# EAGLE design OBD-II-UART (EAGLE 6.4)
DESCRIPTION: microOBD 200 OBD-II Module; HW_REV: 1.4; PCB_REV: C; PCB_SPEC1: Layer Count: 4; PCB_SPEC2: Size: 1.3" x 0.59"; PCB_SPEC3: Finish Thickness: 0.049" - 0.052"; PCB_SPEC4: Copper Weight: 1oz; TITLE: STM1120

## Sheet 1 of 4
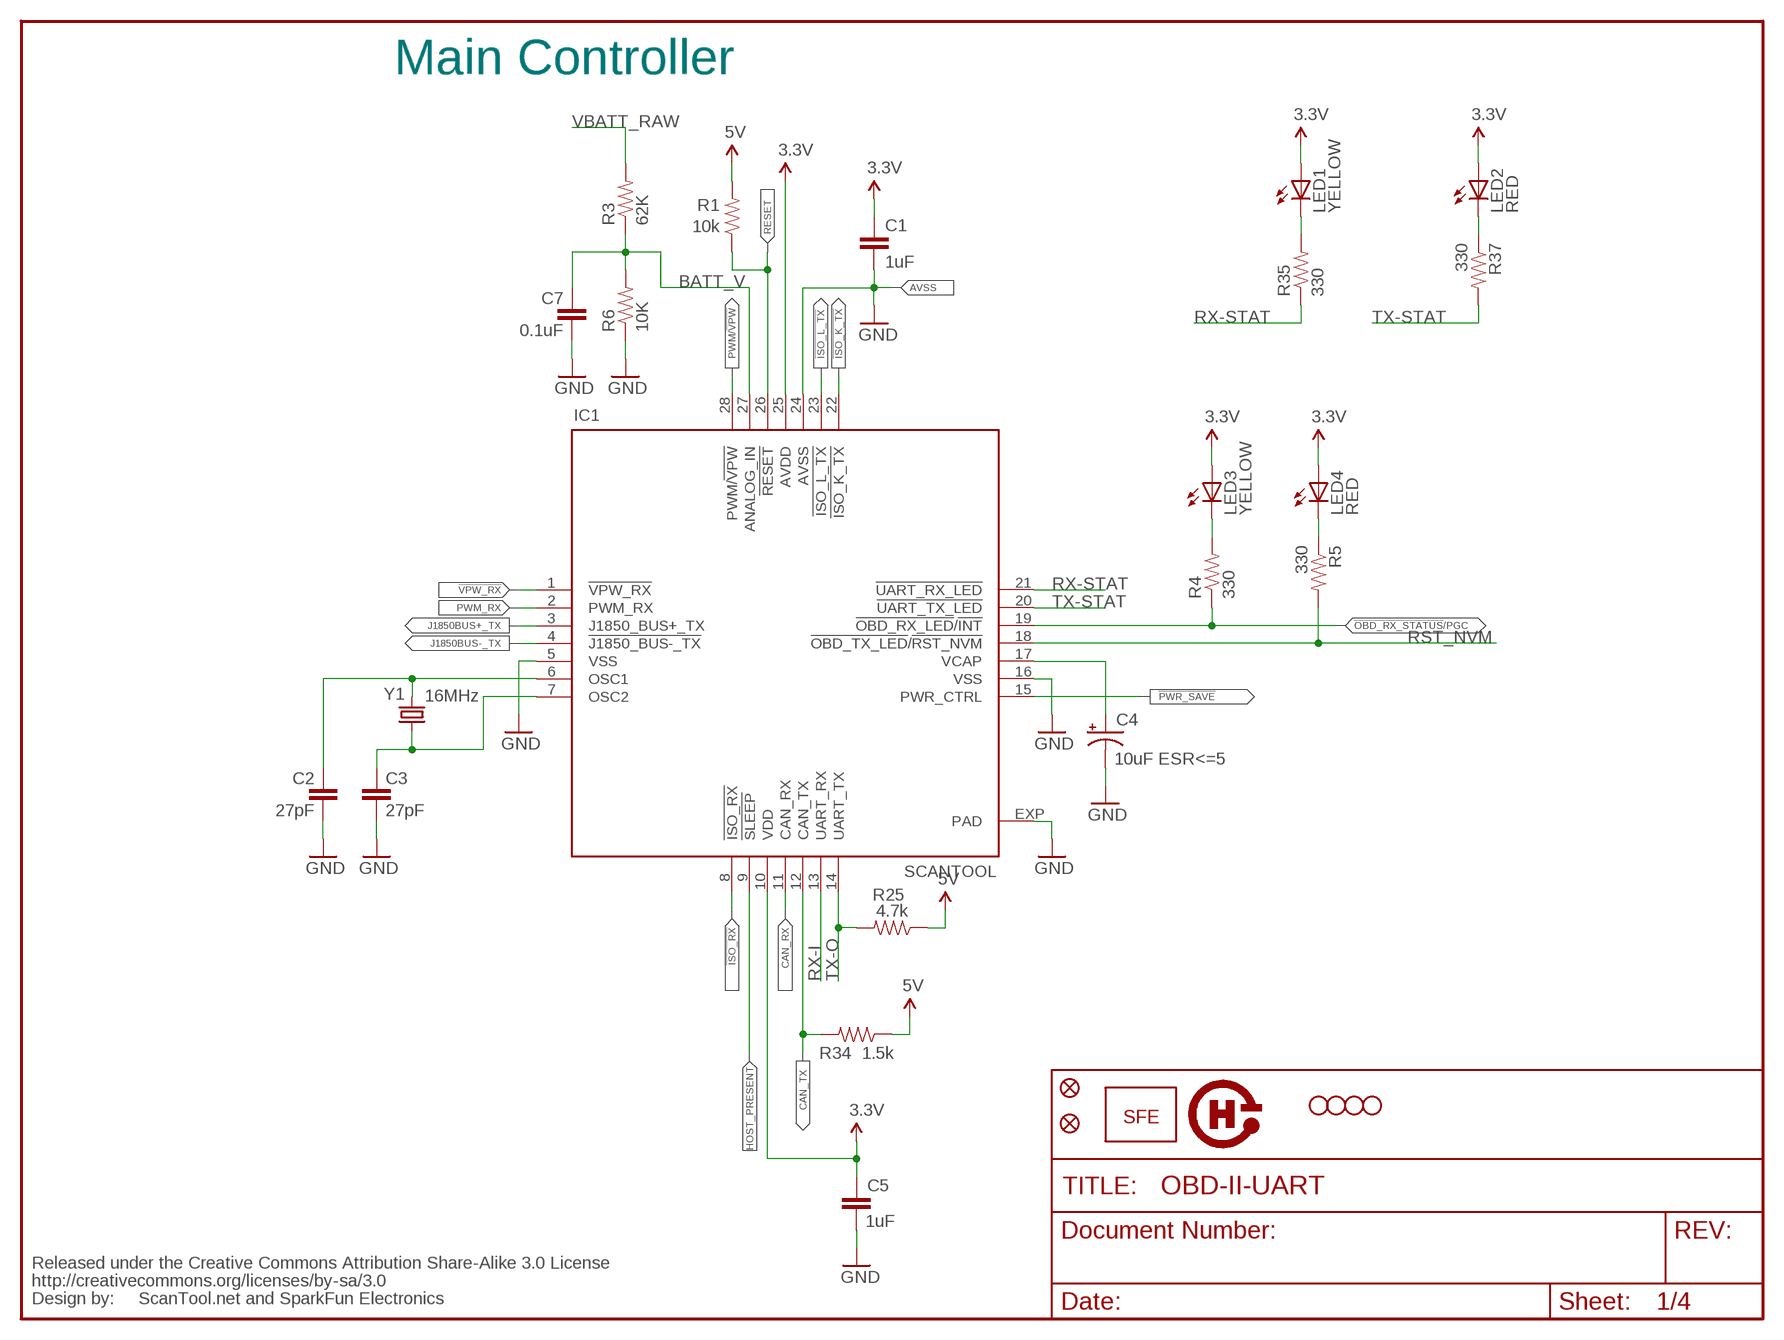
[diagram p0: schematic, sheet 1]

### Parts
C1  1uF  CAP0402-CAP  [0402-CAP]
C2  27pF  CAP0402-CAP  [0402-CAP]
C3  27pF  CAP0402-CAP  [0402-CAP]
C4  10uF ESR<=5  CAP_POL1206  [EIA3216]
C5  1uF  CAP0402-CAP  [0402-CAP]
C7  0.1uF  CAP0402-CAP  [0402-CAP]
IC1  SCANTOOL  [_STN_SCANTOOL_QFN-28-S]
JP2  FIDUCIAL1X2  [FIDUCIAL-1X2]
JP3  LOGO-SFENEW  [SFE-NEW-WEBLOGO]
JP4  STAND-OFF  [STAND-OFF]
JP5  STAND-OFF  [STAND-OFF]
JP6  STAND-OFF  [STAND-OFF]
JP7  STAND-OFF  [STAND-OFF]
JP10  FIDUCIAL1X2  [FIDUCIAL-1X2]
LED1  YELLOW  LED0603  [LED-0603]
LED2  RED  LED0603  [LED-0603]
LED3  YELLOW  LED0603  [LED-0603]
LED4  RED  LED0603  [LED-0603]
R1  10k  RESISTOR0402-RES  [0402-RES]
R3  62K  RESISTOR0402-RES  [0402-RES]
R4  330  RESISTOR0402-RES  [0402-RES]
R5  330  RESISTOR0402-RES  [0402-RES]
R6  10K  RESISTOR0402-RES  [0402-RES]
R25  4.7k  RESISTOR0402-RES  [0402-RES]
R34  1.5k  RESISTOR0402-RES  [0402-RES]
R35  330  RESISTOR0402-RES  [0402-RES]
R37  330  RESISTOR0402-RES  [0402-RES]
U$1  CREATIVE_COMMONS  [CREATIVE_COMMONS]
U$14  OSHW-LOGO  [OSHW-LOGO]
Y1  16MHz  CRYSTAL5X3  [CRYSTAL-SMD-5X3]

### Nets
3.3V: C1.1 C5.1 IC1.10(VDD) IC1.25(AVDD) LED1.A LED2.A LED3.A LED4.A ; also sheet 2,3,4
5V: R1.2 R25.1 R34.1 ; also sheet 2,3,4
!ISO_K_TX: IC1.22(!ISO_K_TX) ; also sheet 3
!ISO_L_TX: IC1.23(!ISO_L_TX) ; also sheet 3
!ISO_RX: IC1.8(!ISO_RX) ; also sheet 3
!OBD_RX_STATUS!/PGC: IC1.19(!OBD_RX_LED!/!INT) R4.1
!PWR_SAVE: IC1.15(PWR_CTRL)
!VPW_RX: IC1.1(!VPW_RX) ; also sheet 4
BATT_V: C7.1 IC1.27(ANALOG_IN) R3.1 R6.2
CAN_RX: IC1.11(CAN_RX) ; also sheet 3
CAN_TX: IC1.12(CAN_TX) R34.2 ; also sheet 3
GND: C1.2 C2.2 C3.2 C4.C(-) C5.2 C7.2 IC1.5(VSS) IC1.16(VSS) IC1.24(AVSS) IC1.EXP(PAD) R6.1 ; also sheet 2,3,4
HOST_PRESENT: IC1.9(!SLEEP)
J1850BUS+_TX: IC1.3(J1850_BUS+_TX) ; also sheet 4
J1850BUS-_TX: IC1.4(!J1850_BUS-_TX) ; also sheet 4
N$26: C4.A(+) IC1.17(VCAP)
N$30: LED3.C R4.2
N$31: LED4.C R5.1
N$35: LED1.C R35.2
N$36: LED2.C R37.1
OSC1: C2.1 IC1.6(OSC1) Y1.3
OSC2: C3.1 IC1.7(OSC2) Y1.1
PWM/!VPW: IC1.28(PWM/!VPW) ; also sheet 4
PWM_RX: IC1.2(PWM_RX) ; also sheet 4
RESET: IC1.26(!RESET) R1.1
RST_NVM: IC1.18(!OBD_TX_LED!/!RST_NVM) R5.2 ; also sheet 2
RX-I: IC1.13(UART_RX) ; also sheet 2
RX-STAT: IC1.21(!UART_RX_LED) R35.1
TX-O: IC1.14(UART_TX) R25.2 ; also sheet 2
TX-STAT: IC1.20(!UART_TX_LED) R37.2
VBATT_RAW: R3.2 ; also sheet 2

### Notes on the sheet
- Main Controller
- AVSS
- ScanTool.net and SparkFun Electronics

## Sheet 2 of 4
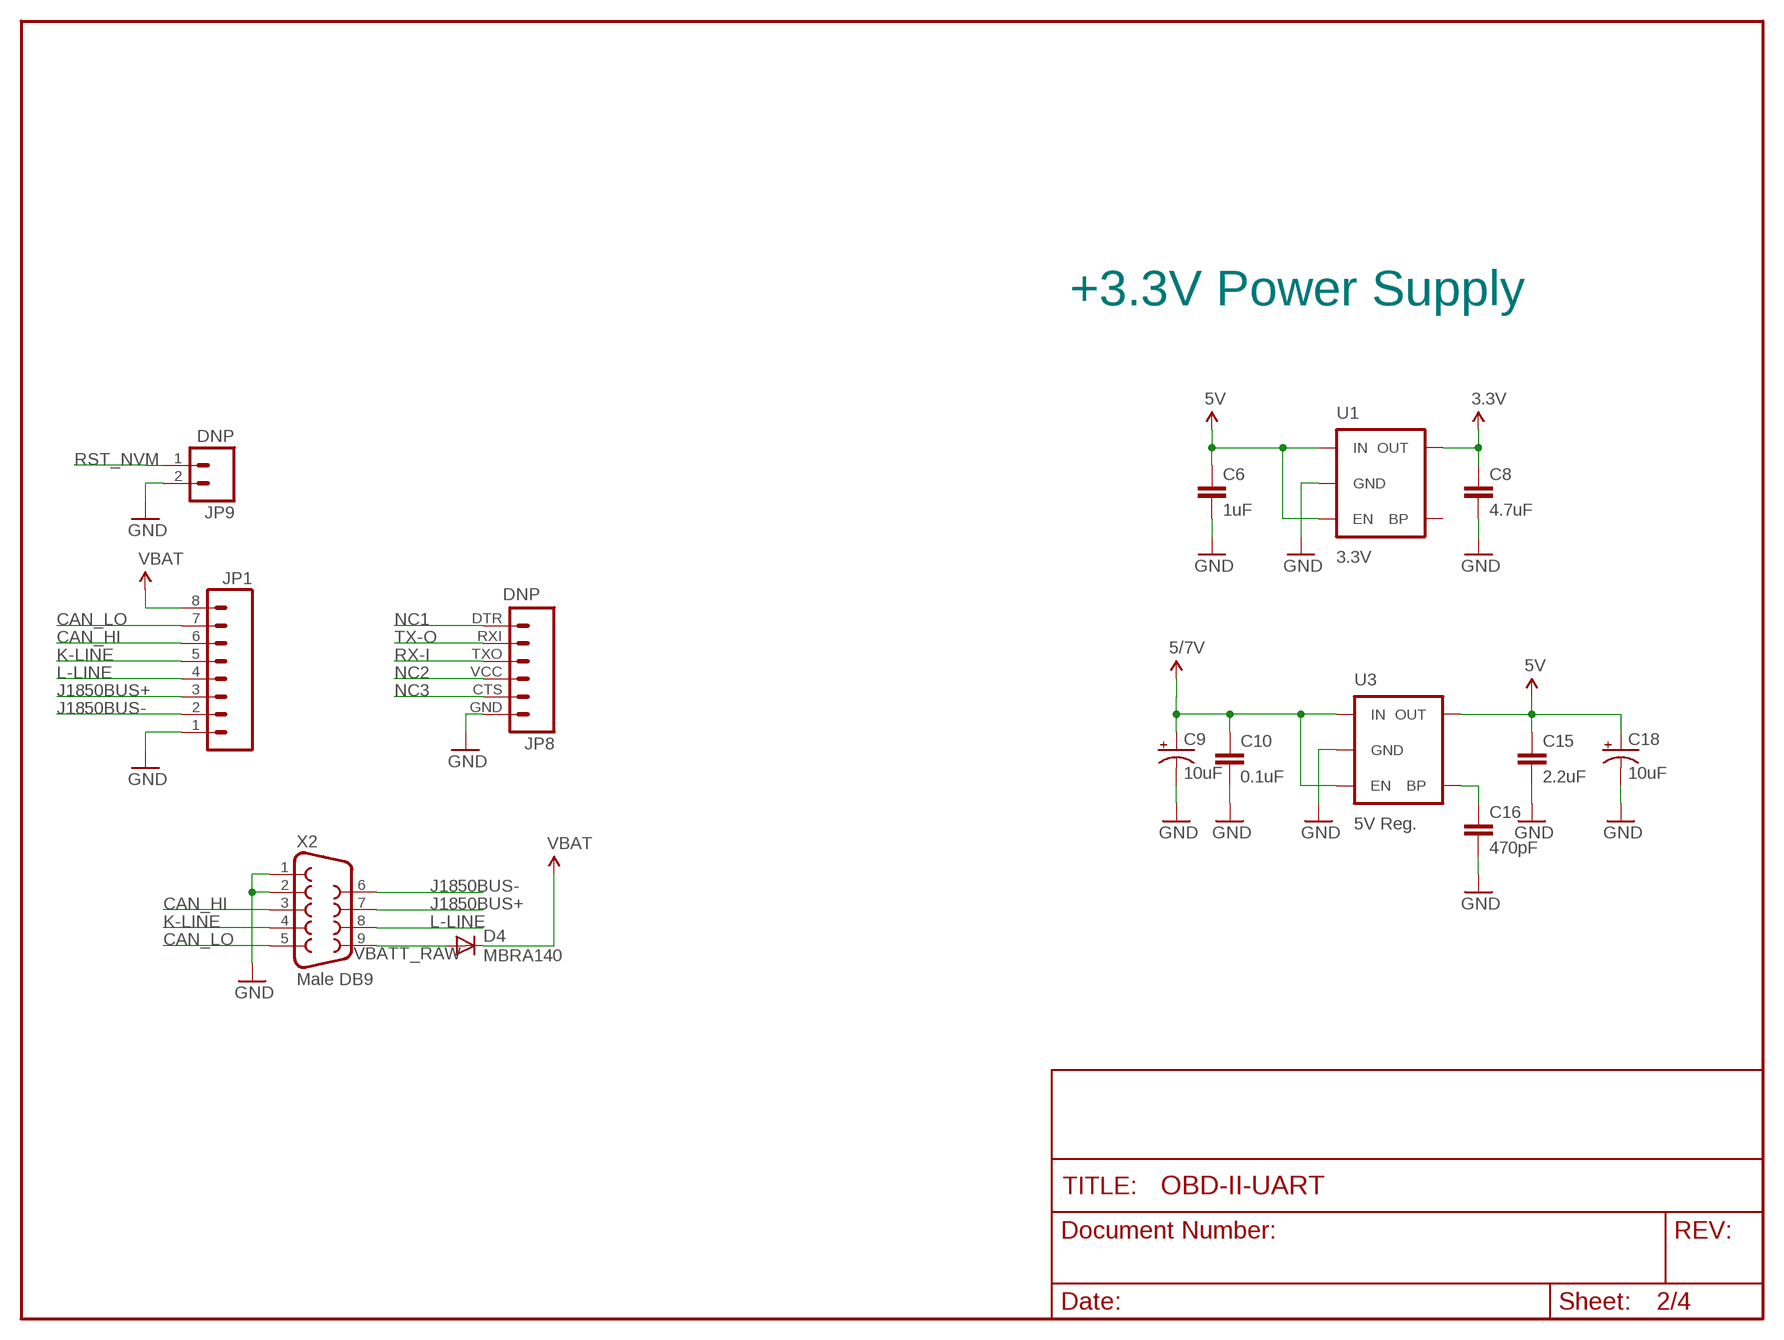
[diagram p1: schematic, sheet 2]

### Parts
C6  1uF  CAP0402-CAP  [0402-CAP]
C8  4.7uF  CAP0402-CAP  [0402-CAP]
C9  10uF  CAP_POL1206  [EIA3216]
C10  0.1uF  CAP0402-CAP  [0402-CAP]
C15  2.2uF  CAP0402-CAP  [0402-CAP]
C16  470pF  CAP0402-CAP  [0402-CAP]
C18  10uF  CAP_POL1206  [EIA3216]
D4  MBRA140  DIODESMA  [SMA-DIODE]
JP1  M08  [1X08]
JP8  DNP  FTDI_BASICPTH  [FTDI_BASIC]
JP9  DNP  M02PTH  [1X02]
U1  3.3V  V_REG_LDOSMD  [SOT23-5]
U3  5V Reg.  V_REG_LDOSMD  [SOT23-5]
X2  Male DB9  DB9MALE  [DB9_MALE]

### Nets
3.3V: C8.1 U1.5(OUT) ; also sheet 1,3,4
5V: C6.1 C15.1 C18.A(+) U1.1(IN) U1.3(EN) U3.5(OUT) ; also sheet 1,3,4
CAN_HI: JP1.6 X2.3 ; also sheet 3
CAN_LO: JP1.7 X2.5 ; also sheet 3
GND: C6.2 C8.2 C9.C(-) C10.2 C15.2 C16.2 C18.C(-) JP1.1 JP8.GND JP9.2 U1.2(GND) U3.2(GND) X2.1 X2.2 ; also sheet 1,3,4
J1850BUS+: JP1.3 X2.7 ; also sheet 4
J1850BUS-: JP1.2 X2.6 ; also sheet 4
K-LINE: JP1.5 X2.4 ; also sheet 3
L-LINE: JP1.4 X2.8 ; also sheet 3
N$34: C16.1 U3.4(BP)
NC1: JP8.DTR
NC2: JP8.VCC
NC3: JP8.CTS
RST_NVM: JP9.1 ; also sheet 1
RX-I: JP8.TXO ; also sheet 1
TX-O: JP8.RXI ; also sheet 1
VBAT: D4.C JP1.8 ; also sheet 3,4
VBATT_RAW: D4.A X2.9 ; also sheet 1
VCC: C9.A(+) C10.1 U3.1(IN) U3.3(EN) ; supply symbol labelled 5/7V ; also sheet 4
Unconnected: U1.4(BP)

### Notes on the sheet
- +3.3V Power Supply

## Sheet 3 of 4
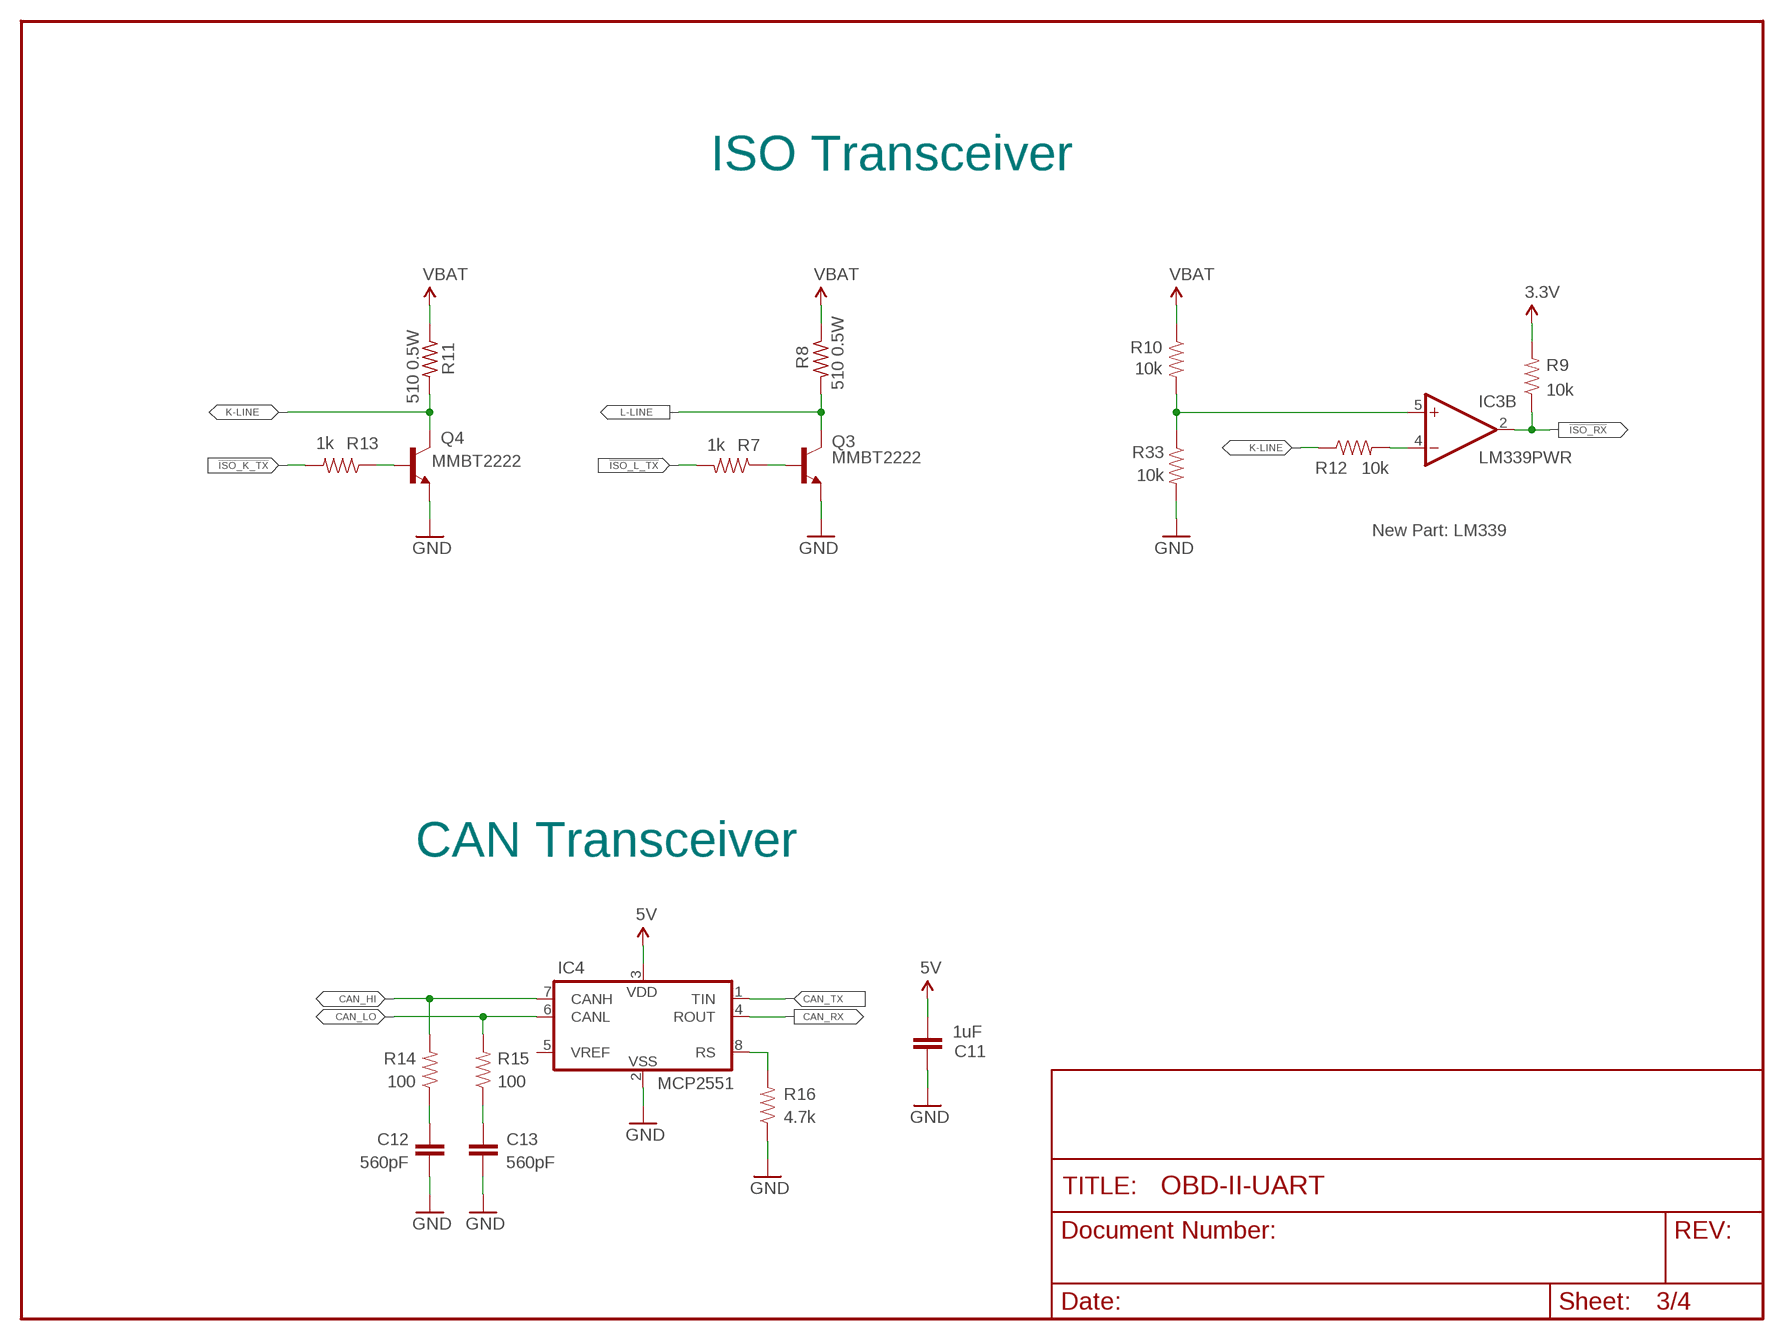
[diagram p2: schematic, sheet 3]

### Parts
C11  1uF  CAP0402-CAP  [0402-CAP]
C12  560pF  CAP0402-CAP  [0402-CAP]
C13  560pF  CAP0402-CAP  [0402-CAP]
IC3  LM339PWR  [TSSOP-14]
IC4  MCP2551  MCP2551-I/SN  [SO-8]
Q3  MMBT2222  TRANSISTOR_NPNSOT23-3  [SOT23-3]
Q4  MMBT2222  TRANSISTOR_NPNSOT23-3  [SOT23-3]
R7  1k  RESISTOR0402-RES  [0402-RES]
R8  510 0.5W  R-US_2010  [2010]
R9  10k  RESISTOR0402-RES  [0402-RES]
R10  10k  RESISTOR0402-RES  [0402-RES]
R11  510 0.5W  R-US_2010  [2010]
R12  10k  RESISTOR0402-RES  [0402-RES]
R13  1k  RESISTOR0402-RES  [0402-RES]
R14  100  RESISTOR0402-RES  [0402-RES]
R15  100  RESISTOR0402-RES  [0402-RES]
R16  4.7k  RESISTOR0402-RES  [0402-RES]
R33  10k  RESISTOR0402-RES  [0402-RES]

### Nets
3.3V: R9.2 ; also sheet 1,2,4
5V: C11.1 IC4.3(VDD) ; also sheet 1,2,4
!ISO_K_TX: R13.2 ; also sheet 1
!ISO_L_TX: R7.2 ; also sheet 1
!ISO_RX: IC3.2(B:OUT) R9.1 ; also sheet 1
CAN_HI: IC4.7(CANH) R14.2 ; also sheet 2
CAN_LO: IC4.6(CANL) R15.2 ; also sheet 2
CAN_RX: IC4.4(ROUT) ; also sheet 1
CAN_TX: IC4.1(TIN) ; also sheet 1
GND: C11.2 C12.2 C13.2 IC4.2(VSS) Q3.2(E) Q4.2(E) R16.1 R33.2 ; also sheet 1,2,4
K-LINE: Q4.3(C) R11.2 R12.1 ; also sheet 2
L-LINE: Q3.3(C) R8.2 ; also sheet 2
N$4: Q4.1(B) R13.1
N$5: Q3.1(B) R7.1
N$6: IC3.5(B:+IN) R10.2 R33.1
N$10: C12.1 R14.1
N$11: IC4.8(RS) R16.2
N$13: IC3.4(B:-IN) R12.2
N$27: C13.1 R15.1
VBAT: R8.1 R10.1 R11.1 ; also sheet 2,4
Unconnected: IC3.10(D:-IN) IC3.11(D:+IN) IC3.13(D:OUT) IC4.5(VREF)

### Notes on the sheet
- ISO Transceiver
- New Part: LM339
- CAN Transceiver

## Sheet 4 of 4
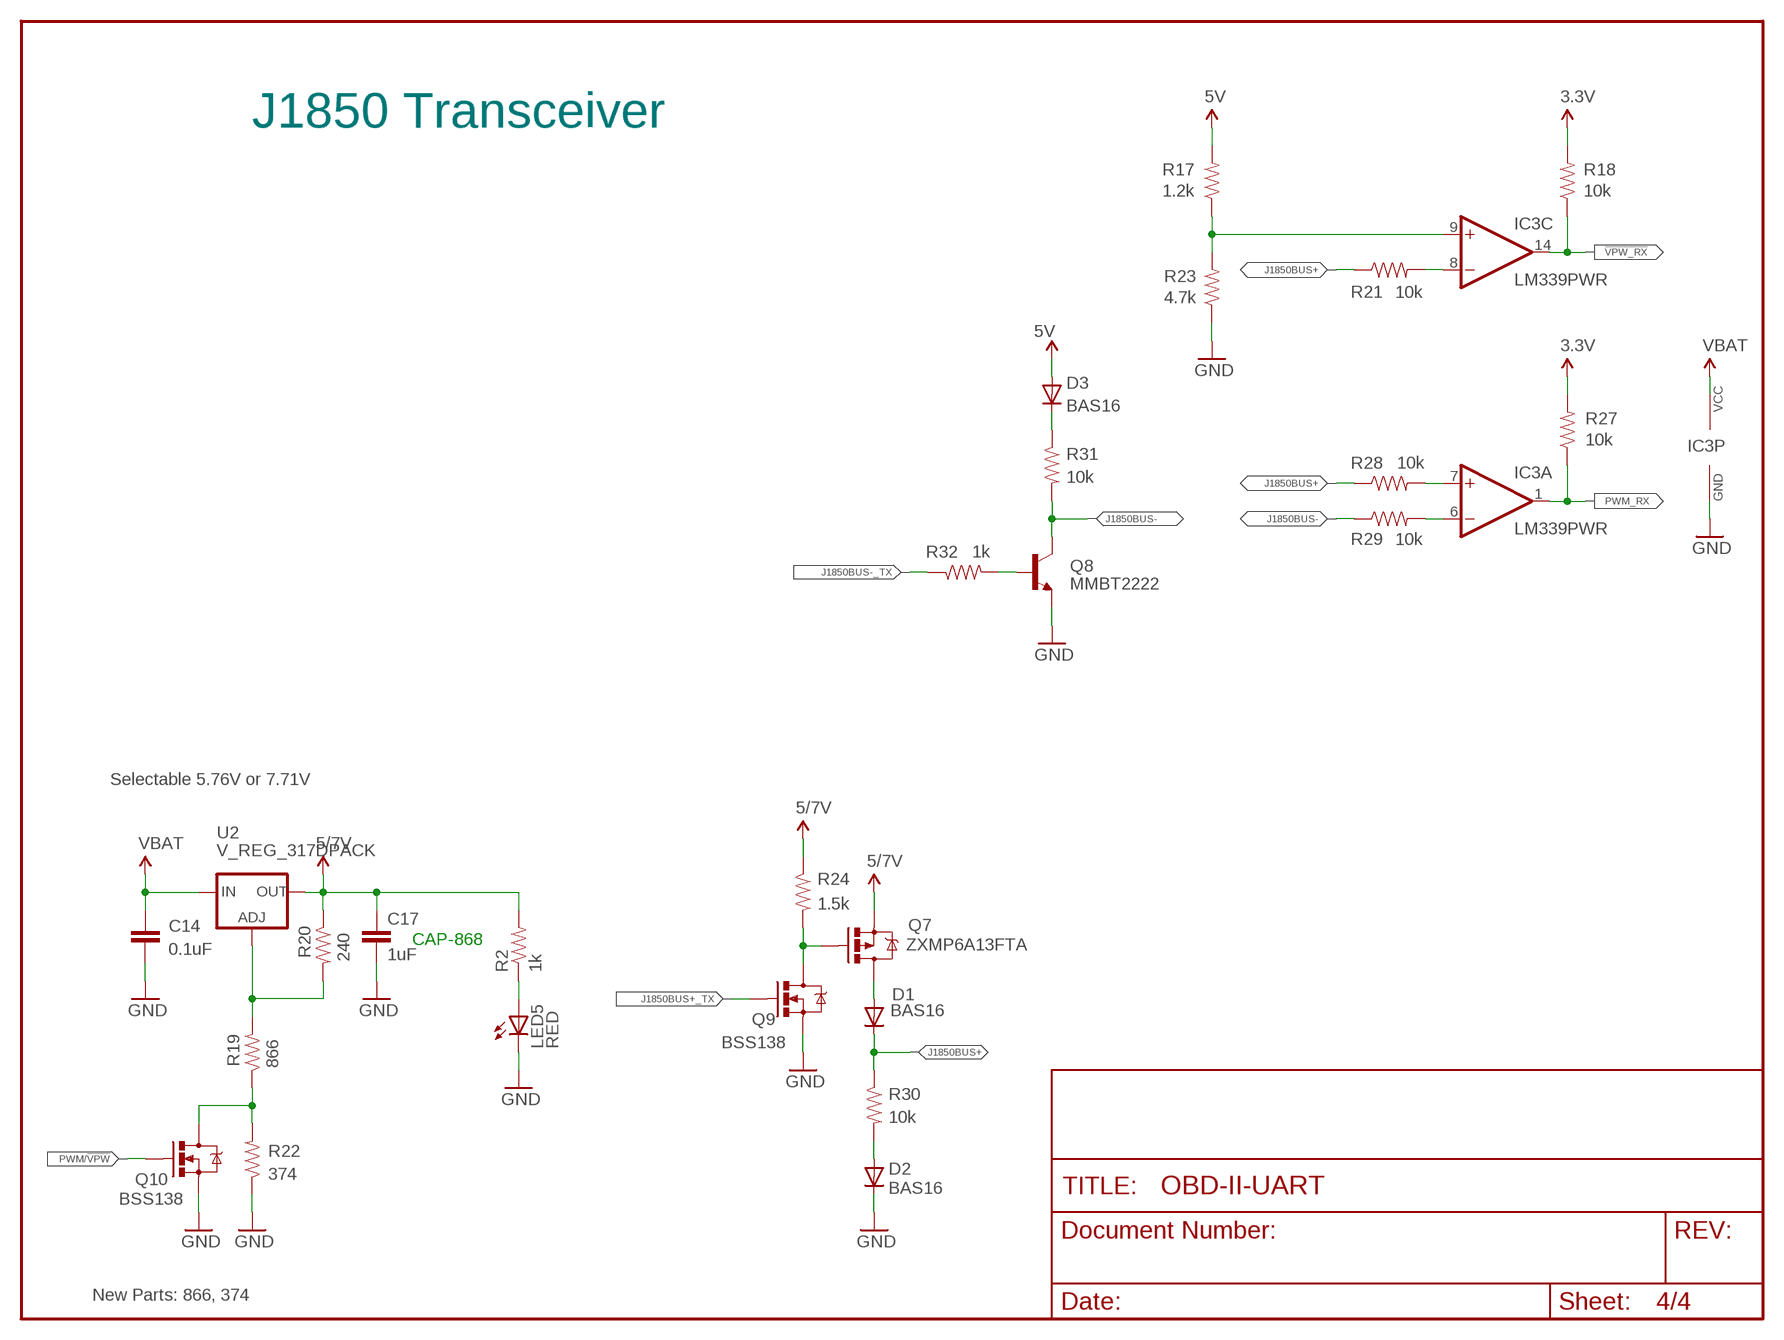
[diagram p3: schematic, sheet 4]

### Parts
C14  0.1uF  CAP0402-CAP  [0402-CAP]
C17  1uF  CAP0402-CAP  [0402-CAP]
D1  BAS16  DIODESOD  [SOD-323]
D2  BAS16  DIODESOD  [SOD-323]
D3  BAS16  DIODESOD  [SOD-323]
LED5  RED  LED0603  [LED-0603]
Q7  ZXMP6A13FTA  MOSFET-PCHANNEL  [SOT23]
Q8  MMBT2222  TRANSISTOR_NPNSOT23-3  [SOT23-3]
Q9  BSS138  MOSFET-NCHANNELSMD  [SOT23-3]
Q10  BSS138  MOSFET-NCHANNELSMD  [SOT23-3]
R2  1k  RESISTOR0402-RES  [0402-RES]
R17  1.2k  RESISTOR0402-RES  [0402-RES]
R18  10k  RESISTOR0402-RES  [0402-RES]
R19  866  RESISTOR0402-RES  [0402-RES]
R20  240  RESISTOR0402-RES  [0402-RES]
R21  10k  RESISTOR0402-RES  [0402-RES]
R22  374  RESISTOR0402-RES  [0402-RES]
R23  4.7k  RESISTOR0402-RES  [0402-RES]
R24  1.5k  RESISTOR0402-RES  [0402-RES]
R27  10k  RESISTOR0402-RES  [0402-RES]
R28  10k  RESISTOR0402-RES  [0402-RES]
R29  10k  RESISTOR0402-RES  [0402-RES]
R30  10k  RESISTOR0402-RES  [0402-RES]
R31  10k  RESISTOR0402-RES  [0402-RES]
R32  1k  RESISTOR0402-RES  [0402-RES]
U2  V_REG_317DPACK  [V-REG_DPACK]

### Nets
3.3V: R18.2 R27.2 ; also sheet 1,2,3
5V: D3.2(A) R17.2 ; also sheet 1,2,3
!VPW_RX: IC3.14(C:OUT) R18.1 ; also sheet 1
GND: C14.2 C17.2 D2.1(C) IC3.12(P:GND) LED5.C Q8.2(E) Q9.2(S) Q10.2(S) R22.1 R23.1 ; also sheet 1,2,3
J1850BUS+: D1.1(C) R21.1 R28.1 R30.1 ; also sheet 2
J1850BUS+_TX: Q9.1(G) ; also sheet 1
J1850BUS-: Q8.3(C) R29.1 R31.2 ; also sheet 2
J1850BUS-_TX: R32.1 ; also sheet 1
N$1: IC3.7(A:+IN) R28.2
N$3: IC3.6(A:-IN) R29.2
N$7: IC3.8(C:-IN) R21.2
N$8: R19.2 R20.2 U2.1(ADJ)
N$9: D1.2(A) Q7.3(D)
N$12: IC3.9(C:+IN) R17.1 R23.2
N$14: D3.1(C) R31.1
N$18: Q7.1(G) Q9.3(D) R24.2
N$22: Q10.3(D) R19.1 R22.2
N$24: D2.2(A) R30.2
N$25: Q8.1(B) R32.2
N$32: LED5.A R2.1
PWM/!VPW: Q10.1(G) ; also sheet 1
PWM_RX: IC3.1(A:OUT) R27.1 ; also sheet 1
VBAT: C14.1 IC3.3(P:VCC) U2.3(IN) ; also sheet 2,3
VCC: C17.1 Q7.2(S) R2.2 R20.1 R24.1 U2.4(OUT) ; supply symbol labelled 5/7V ; also sheet 2

### Notes on the sheet
- J1850 Transceiver
- Selectable 5.76V or 7.71V
- CAP-868
- New Parts: 866, 374

## Library data of the parts
C1-C3 C5-C8 C10-C17 = SparkFun:CAP: Capacitor Standard 0603 ceramic capacitor, and 0.1" leaded capacitor.
C4 C9 C18 = SparkFun:CAP_POL: Capacitor Polarized These are standard SMD and PTH capacitors. Normally 10uF, 47uF, and 100uF in electrolytic and tantalum varieties. Always verify the external diameter of the through hole cap, it varies with capacity, voltage, and manufacturer. The EIA devices should be standard.
D1-D4 = SparkFun:DIODE: Diode These are standard reverse protection diodes and small signal diodes. SMA package can handle up to about 1A. SOD-323 can handle about 200mA. What the SOD-323 package when ordering, there are some mfgs out there that are 5-pin packages.
IC1 = SparkFun:SCANTOOL: STN1110 - Multiprotocol OBD II to UART Interpreter, QFN Package Change Log Date Author Change Aug 23, 2010 vit@scantool.net Created device
IC3 = _stn_logic:LM339PWR: Quad Differential Comparators Based on information from the SLCS006N datasheet from TI (www.ti.com). Change Log Date Author Change July 16, 2008 nick@scantool.net Device created.; DESC: IC, Quad Comparator; MANUF: Texas Instruments; PARTNUM: LM339PWR; SUPPLIER: Digikey:296-6607-1-ND; VALSTAT: PARTNUM
IC4 = _stn_microchip:MCP2551: CAN Driver Based on information from the MPC2551 datasheet from Microchip. http://www.microchip.com/ Change Log Date Author Change November 12, 2008 joe@scantool.net Renamed "TXD" to "TIN" and "RXD" to "ROUT" Fixed mislabeled pins "CANH" and CANL"; DESC: IC, CAN Transceiver; MANUF: Microchip Technology; PARTNUM: MCP2551-I/SN; SUPPLIER: Digikey:MCP2551-I/SN-ND; VALSTAT: PARTNUM
JP1 = SparkFun:M08: Header 8 Standard 8-pin 0.1" header. Use with straight break away headers (SKU : PRT-00116), right angle break away headers (PRT-00553), swiss pins (PRT-00743), machine pins (PRT-00117), and female headers (PRT-00115).
JP2 JP10 = SparkFun:FIDUCIAL: Fiducial Alignment Points Various fiducial points for machine vision alignment.
JP3 = SparkFun:LOGO-SFE: Spark Fun Electronics PCB Logo This is the standard Spark Fun Electronics PCB logo.
JP4-JP7 = SparkFun:STAND-OFF: Stand Off This is the mechanical footprint for a #4 phillips button head screw. Use the keepout ring to avoid running the screw head into surrounding components. SKU : PRT-00447
JP8 = SparkFun:FTDI_BASIC: FTDI Basic: 3.3V and 5V
JP9 = SparkFun:M02: Header 2 Standard 2-pin 0.1" header. Use with straight break away headers (SKU : PRT-00116), right angle break away headers (PRT-00553), swiss pins (PRT-00743), machine pins (PRT-00117), and female headers (PRT-00115). Molex polarized connector foot print use with SKU : PRT-08233 with associated crimp pins and housings.
LED1-LED5 = SparkFun:LED: LEDs Standard schematic elements and footprints for 5mm, 3mm, 1206, and 0603 sized LEDs. 5mm - Spark Fun Electronics SKU : COM-00529 (and others)
Q3 Q4 Q8 = SparkFun:TRANSISTOR_NPN: Transistor NPN BJT configuration in SOT23 package. MMBT2222 is the common NPN we use. Double check BCE configuration again layout.
Q7 = SparkFun:MOSFET-PCHANNEL
Q9 Q10 = SparkFun:MOSFET-NCHANNEL
R1-R7 R9 R10 R12-R25 R27-R35 R37 = SparkFun:RESISTOR: Resistor Basic schematic elements and footprints for 0603, 1206, and PTH resistors.
R8 R11 = _stn_rcl:R-US: Resistor, US Symbol Change Log Date Author Change November 13, 2006 vit@scantool.net Moved underscore from the end of device name to beginning of variant names. May 27, 2006 vitaliy@scantool.net Added description.; DESC: Resistor; VALSTAT: VAL
U1 U3 = SparkFun:V_REG_LDO: Voltage Regulator LDO Standard 150mA LDO voltage regulator in SOT-23 layout. Micrel part MIC5205. BP (by-pass) pin is used to lower output noise with 470pF cap.
U2 = SparkFun:V_REG_317: Voltage Regulator Standard LM317 adjustable voltage regulator. AOI (Adjust Output Input). Google 'LM317 Calculator' for easy to use app to get the two resistor values needed. 240/720 for 5V output. 240/390 for 3.3V output. Spark Fun Electronics SKU : COM-00527
U$1 = SparkFun:CREATIVE_COMMONS
U$14 = OSHW:OSHW-LOGO
X2 = SparkFun:DB9: DB9 Connector Standard DB9 (D-Sub 9) serial connector. Can be used for CAN bus as well as RS485 and RS232. Footprint production proven. Spark Fun Electronics SKU : PRT-00429
Y1 = SparkFun:CRYSTAL: Crystals Various standard crystals. Proven footprints. Spark Fun Electronics SKU : COM-00534

## Board
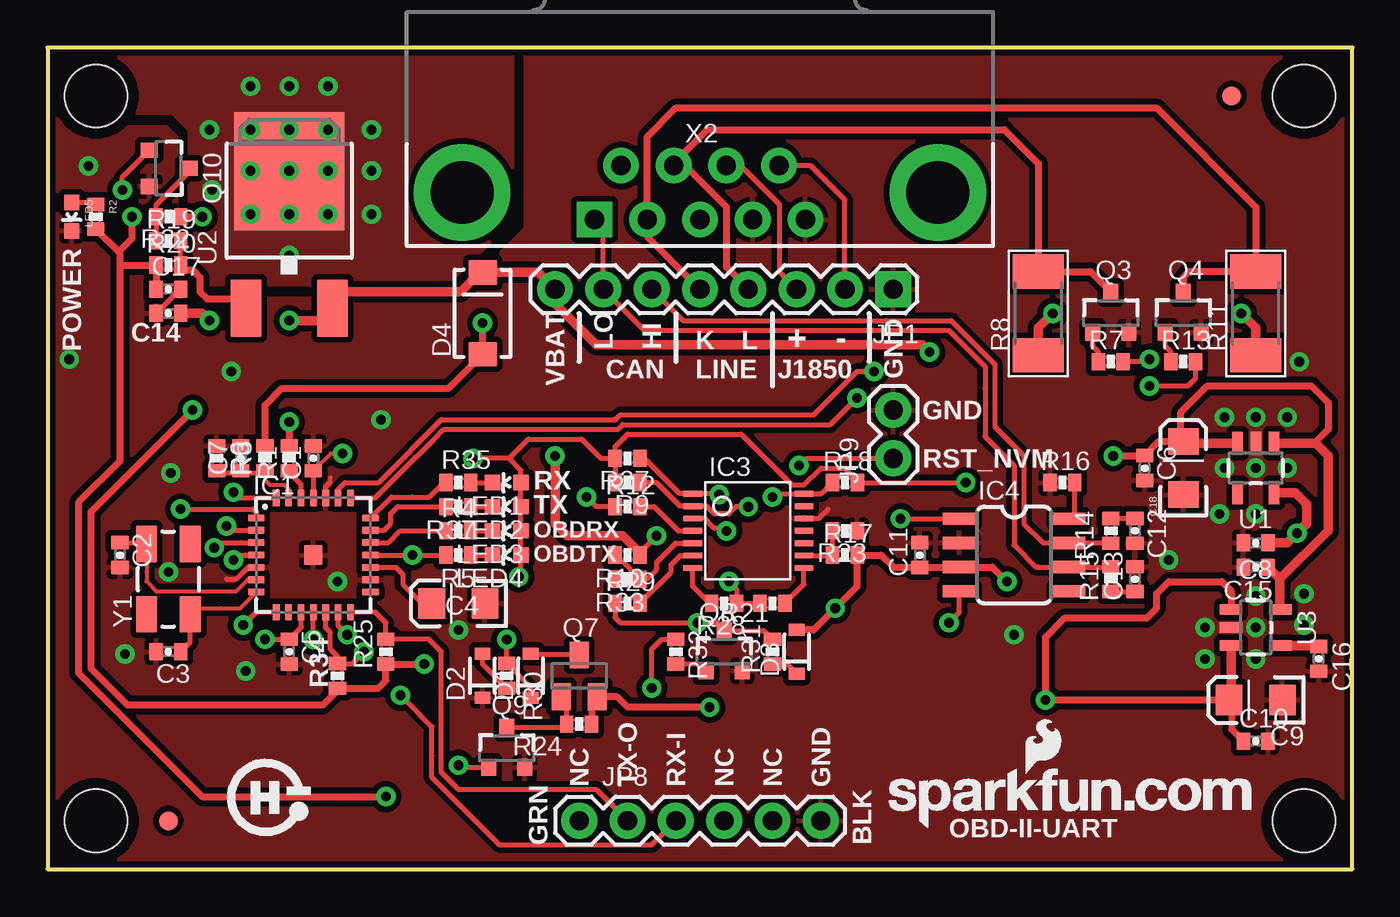
[diagram p4: board, top side]
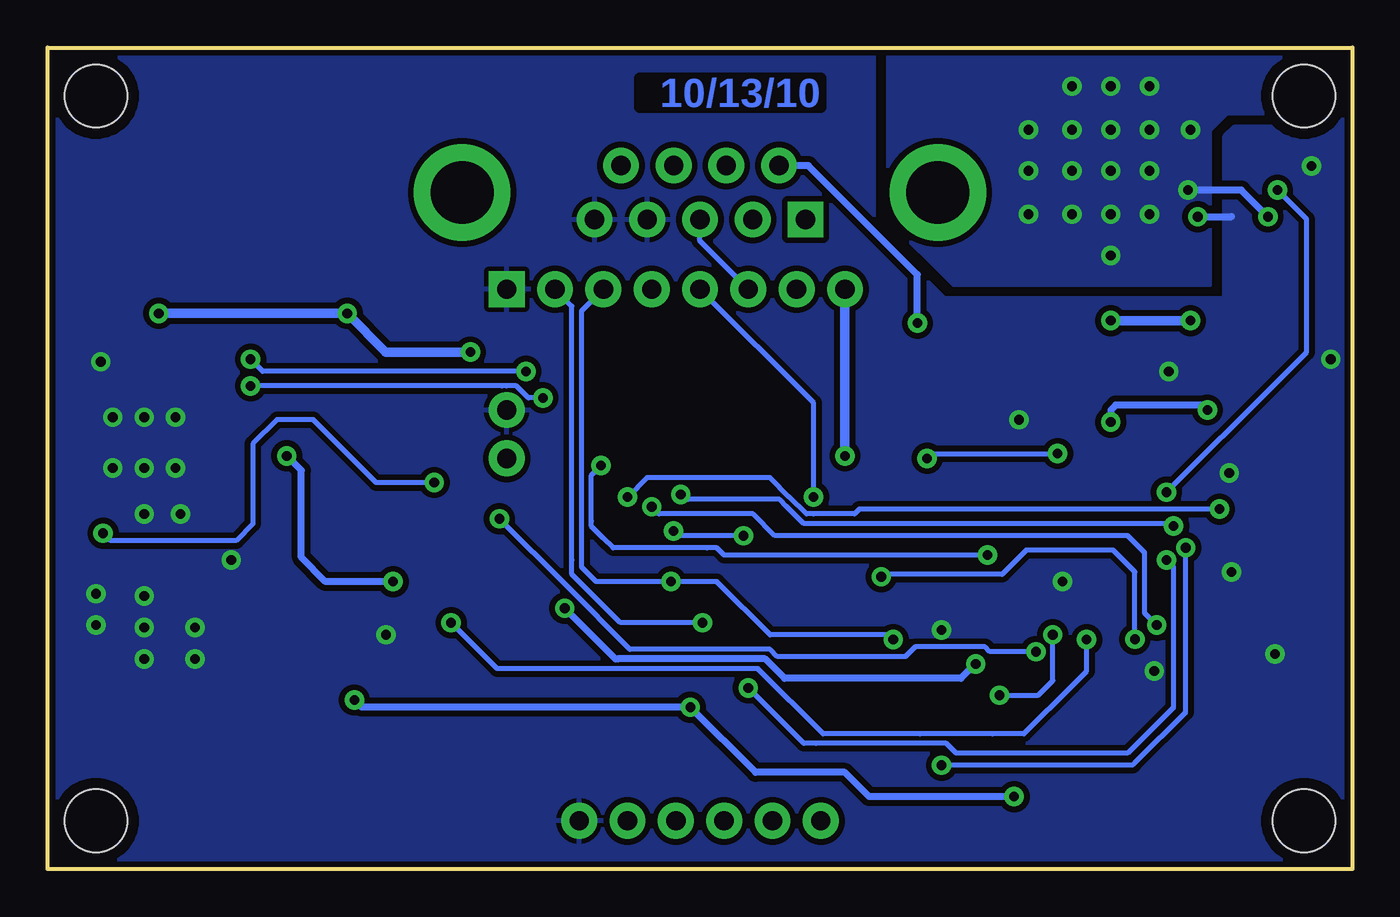
[diagram p5: board, bottom side, seen from below]

Size 68.58 x 43.18 mm. Coordinates in mm from the lower left corner, seen from the top.
Outline: 0,0 68.58,0 68.58,43.18 0,43.18 0,0
Copper layers (1*16): Top 0.035mm / dielectric 1.5mm / Bottom 0.035mm
Design rules "SparkFun *": minimum track width 8mil, minimum drill 20mil, track to track 6mil, track to pad 6mil, pad to pad 6mil, via to via 6mil, smd to smd 6mil, copper to edge 8mil, drill to drill 8mil, minimum pad ring 12mil, minimum via ring 10mil, stop-mask expansion 4mil, vias tented up to drill 20mil, thermal gap 10mil

### Footprints (pad centres in the part's own frame; a part is rotated, then mirrored left to right if it is on the bottom)
0402-CAP = smd 0.7 x 0.9: 1 -0.65,0; 2 0.65,0
EIA3216 = smd 1.4 x 1.6: A 1.4,0; C -1.4,0
SOD-323 = smd 0.63 x 0.83: 1 -1.15,0; 2 1.15,0
SMA-DIODE = smd 1.27 x 1.47: A -2.15,0; C 2.15,0
_STN_SCANTOOL_QFN-28-S = smd 0.85 x 0.35: 1 -3,1.95; 2 -3,1.3; 3 -3,0.65; 4 -3,0; 5 -3,-0.65; 6 -3,-1.3; 7 -3,-1.95; 15 3,-1.95; 16 3,-1.3; 17 3,-0.65; 18 3,0; 19 3,0.65; 20 3,1.3; 21 3,1.95 | smd 0.35 x 0.85: 8 -1.95,-3; 9 -1.3,-3; 10 -0.65,-3; 11 0,-3; 12 0.65,-3; 13 1.3,-3; 14 1.95,-3; 22 1.95,3; 23 1.3,3; 24 0.65,3; 25 0,3; 26 -0.65,3; 27 -1.3,3; 28 -1.95,3 | smd 1 x 1: EXP 0,0
TSSOP-14 = smd 0.305 x 0.991: 1 -1.95,-2.925; 2 -1.3,-2.925; 3 -0.65,-2.925; 4 0,-2.925; 5 0.65,-2.925; 6 1.3,-2.925; 7 1.95,-2.925; 8 1.95,2.925; 9 1.3,2.925; 10 0.65,2.925; 11 0,2.925; 12 -0.65,2.925; 13 -1.3,2.925; 14 -1.95,2.925
SO-8 = smd 0.65 x 1.75: 1 -1.905,-2.873; 2 -0.635,-2.873; 3 0.635,-2.873; 4 1.905,-2.873; 5 1.905,2.873; 6 0.635,2.873; 7 -0.635,2.873; 8 -1.905,2.873
1X08 = drill 1.016 pad 1.88 square: 1 0,0 | drill 1.016 pad 1.88: 2 2.54,0; 3 5.08,0; 4 7.62,0; 5 10.16,0; 6 12.7,0; 7 15.24,0; 8 17.78,0
FIDUCIAL-1X2 = smd 1 x 1: 1 0,0
STAND-OFF = hole 3.302: 0,0
FTDI_BASIC = drill 1.016 pad 1.88: CTS 10.16,0; DTR 0,0; GND 12.7,0; RXI 2.54,0; TXO 5.08,0; VCC 7.62,0
1X02 = drill 1.016 pad 1.88: 1 0,0; 2 2.54,0
LED-0603 = smd 0.8 x 0.8: A 0,-0.75; C 0,0.75
SOT23-3 = smd 0.8 x 0.9: 1 -0.95,-1; 2 0.95,-1; 3 0,1.1
SOT23 = smd 1 x 1.4: 1 -0.95,-1.1; 2 0.95,-1.1; 3 0,1.1
0402-RES = smd 0.7 x 0.9: 1 -0.65,0; 2 0.65,0
2010 = smd 1.8 x 2.7: 1 -2.2,0; 2 2.2,0
SOT23-5 = smd 0.55 x 1.2: 1 -0.95,-1.3; 2 0,-1.3; 3 0.95,-1.3; 4 0.95,1.3; 5 -0.95,1.3
V-REG_DPACK = smd 1.6 x 3: 1 -2.28,-4.8; 3 2.28,-4.8 | smd 5.8 x 6.2: 4 0,2.38
DB9_MALE = drill 1.016 pad 1.88: 1 5.54,-1.42; 2 2.77,-1.42; 3 0,-1.42; 4 -2.77,-1.42; 6 4.15,1.42; 7 1.38,1.42; 8 -1.38,1.42; 9 -4.15,1.42 | drill 1.016 pad 1.88 square: 5 -5.54,-1.42 | drill 3.302 pad 5.08: G1 -12.5,0; G2 12.5,0
CRYSTAL-SMD-5X3 = smd 1.9 x 1.1: 1 -1.85,-1.15; 2 1.85,-1.15; 3 1.85,1.15; 4 -1.85,1.15

### Placement (x,y rotation side)
C1  13.97,21.59 90 top
C2  3.81,16.51 270 top
C3  6.35,11.43 180 top
C4  21.59,13.97 180 top
C5  12.7,11.43 270 top
C6  57.66,21.08 270 top
C7  10.16,21.59 90 top
C8  63.5,17.14 180 top
C9  63.5,8.89 180 top
C10  63.5,6.73 0 top
C11  45.85,16.51 90 top
C12  57.15,17.78 270 top
C13  57.15,15.24 90 top
C14  6.35,29.21 180 top
C15  63.5,15.88 180 top
C16  66.8,11.05 270 top
C17  6.35,30.48 0 top
C18  59.69,21.08 90 top
D1  25.4,10.16 90 top
D2  22.86,10.16 90 top
D3  39.37,11.43 90 top
D4  22.86,29.21 90 top
IC1  13.97,16.51 0 top
IC3  36.83,17.78 270 top
IC4  50.8,16.51 270 top
JP1  44.45,30.48 180 top
JP2  6.35,2.54 0 top
JP3  44.2,2.16 0 top
JP4  2.54,2.54 0 top
JP5  66.04,40.64 0 top
JP6  66.04,2.54 0 top
JP7  2.54,40.64 0 top
JP8  27.94,2.54 0 top
JP9  44.45,21.59 90 top
JP10  62.23,40.64 0 top
LED1  24.13,20.32 90 top
LED2  24.13,19.05 90 top
LED3  24.13,17.78 90 top
LED4  24.13,16.51 90 top
LED5  1.27,34.29 180 top
Q3  55.88,29.21 0 top
Q4  59.69,29.21 0 top
Q7  27.94,10.16 0 top
Q8  35.56,11.43 0 top
Q9  24.13,6.35 0 top
Q10  6.35,36.83 270 top
R1  12.7,21.59 90 top
R2  2.54,34.29 270 top
R3  11.43,21.59 90 top
R4  21.59,17.78 0 top
R5  21.59,16.51 180 top
R6  8.89,21.59 270 top
R7  55.88,26.67 0 top
R8  52.07,29.21 90 top
R9  30.48,20.32 180 top
R10  30.48,16.51 180 top
R11  63.5,29.21 90 top
R12  30.48,19.05 0 top
R13  59.69,26.67 0 top
R14  55.88,17.78 270 top
R15  55.88,15.24 90 top
R16  53.34,20.32 0 top
R17  41.91,16.51 0 top
R18  41.91,20.32 0 top
R19  6.35,33.02 0 top
R20  6.35,31.75 0 top
R21  38.1,13.97 0 top
R22  6.35,34.29 180 top
R23  41.91,17.78 180 top
R24  27.94,7.62 180 top
R25  17.78,11.43 90 top
R27  30.48,21.59 180 top
R28  35.56,13.97 180 top
R29  30.48,13.97 0 top
R30  24.13,10.16 270 top
R31  38.1,11.43 90 top
R32  33.02,11.43 270 top
R33  30.48,15.24 180 top
R34  15.24,10.16 90 top
R35  21.59,20.32 0 top
R37  21.59,19.05 180 top
U1  63.5,21.08 180 top
U2  12.7,34.29 0 top
U3  63.5,12.7 270 top
U$1  20.32,-15.24 0 top  (outside the outline)
U$14  11.43,3.81 0 top
X2  34.29,35.56 0 top
Y1  6.35,15.24 90 top

### Tracks (layer width: path | path; a pad name or v marks a point on that pad's centre or on a via)
3.3V  (via drill 0.51)
  Top 0.203: C1.1 14.87,21.84 v15.49,21.84
  Top 0.254: LED4.A 24.89,16.51 24.88,16.52 LED4.A | 13.97,20.95 C1.1 IC1.25 | IC1.10 13.34,13.49 13.34,12.71 C5.1 v11.43,12.08 11.43,12.06 | R27.2 29.84,21.57 29.84,20.34 R9.2 29.72,20.32 | R27.2 29.83,22.21 30.48,22.86 36.45,22.86 39.12,20.19 39.75,20.19 40.64,21.08 41.91,21.08 42.56,20.43 R18.2 v48.26,20.32 | LED4.A 24.88,15.48 v24.77,15.37 | LED4.A 24.88,17.64 24.89,17.65 24.88,17.66 LED3.A 24.88,17.89 24.89,17.91 24.88,17.92 LED2.A 24.89,19.05 24.88,19.06 LED1.A 24.88,20.97 24.26,21.59 | R27.2 29.08,21.59 28.07,22.61 25.27,22.61 24.26,21.59 | 24.26,21.59 v22.35,21.59
  Top 0.508: U1.5 65.56,19.78 66.17,19.18 66.17,18.16 65.91,17.91 v65.66,17.65 65.15,17.14 C8.1
  Bottom 0.254: v48.26,20.32 51.31,20.32 54.61,23.62 56.52,23.62 57.78,22.35 57.78,18.16 58.67,17.27 65.28,17.27 v65.66,17.65 | v22.35,21.59 22.1,21.84 v15.49,21.84 | v24.77,15.37 24.64,15.49 18.41,15.49 17.14,16.76 12.57,16.76 11.43,15.62 v11.43,12.08
5V  (via drill 0.51)
  Top 0.254: IC4.3 47.88,15.88 47.86,15.89 | 17.77,10.78 17.78,10.79 R25.1 17.78,10.67 | 64.77,13.72 64.77,13.68 U3.5 | 42.55,16.38 42.56,16.4 R17.2 42.8,16.51
  Top 0.381: D3.2 40.27,12.58 v41.4,13.72 42.55,14.86 42.55,16.38 | 42.8,16.51 43.81,16.51 44.47,15.86 C11.1 47.83,15.86 47.86,15.89 | R25.1 v19.8,10.78 | 17.78,10.67 17.78,9.91 17.38,9.51 R34.1 15.24,9.4 14.48,8.64 4.19,8.64 2.29,10.54 2.29,18.8 v7.62,24.13 | IC4.3 49.66,15.88 v50.42,15.11 | v12.7,23.5 R1.2 | v56.01,21.72 56.02,21.73 C6.1 58.41,22.48 59.56,22.48 59.56,24 60.96,25.4 66.42,25.4 67.31,24.51 67.31,23.11 66.58,22.38 66.61,22.35 66.67,22.35
  Top 0.508: 64.77,15.26 C15.1 | 64.77,15.26 64.77,13.72 | U1.3 59.66,22.38 59.56,22.48 C18.A | 64.77,15.26 67.31,17.8 67.31,21.72 66.67,22.35 | 66.58,22.38 U1.1
  Bottom 0.254: 38.61,11.05 38.73,11.05 | v19.8,10.78 19.81,10.79
  Bottom 0.381: 38.61,11.05 30.86,11.05 29.84,10.03 20.57,10.03 19.81,10.79 | 38.73,11.05 v41.4,13.72 | v50.42,15.11 53.98,15.11 55.24,16.38 55.24,20.95 v56.01,21.72 | v12.7,23.5 12.7,24.13 12.45,24.38 7.87,24.38 v7.62,24.13
!ISO_K_TX  (via drill 0.51)
  Top 0.254: IC1.22 17.22,19.51 18.54,20.83 20.32,22.61 20.83,23.11 22.1,23.11 29.97,23.11 30.23,23.37 41.15,23.37 v42.55,24.77 | v57.91,25.4 59.94,25.4 60.33,25.78 60.34,25.8 R13.2
  Bottom 0.254: v57.91,25.4 44.7,25.4 44.45,25.4 43.94,25.4 43.31,24.77 v42.55,24.77
!ISO_L_TX  (via drill 0.51)
  Top 0.254: IC1.23 15.27,19.97 15.62,20.32 17.4,20.32 18.16,21.08 20.07,22.99 20.19,23.11 20.7,23.62 29.72,23.62 29.84,23.62 29.97,23.75 30.1,23.88 31.24,23.88 40.26,23.88 42.55,26.16 42.67,26.16 v43.43,26.16 | R7.2 57.78,26.67 v57.91,26.8
  Bottom 0.254: v43.43,26.16 57.28,26.16 v57.91,26.8
!ISO_RX  (via drill 0.51)
  Top 0.254: R9.1 32,20.32 33.24,19.08 IC3.2 34.64,19.08 35.05,18.67 35.81,18.67 36.2,19.05 v36.83,19.05 | IC1.8 10.97,13.51 v10.29,12.83
  Bottom 0.254: v36.83,19.05 36.45,18.67 31.5,18.67 30.35,17.53 11.81,17.53 10.92,16.64 10.92,13.46 v10.29,12.83
!OBD_RX_STATUS!/PGC
  Top 0.254: IC1.19 17.92,17.16 18.54,17.78 20.7,17.78 R4.1
!VPW_RX  (via drill 0.51)
  Top 0.254: v38.1,19.56 38.27,19.73 IC3.14 40.59,19.73 40.69,19.73 41.15,20.19 41.26,20.3 R18.1 | IC1.1 10.97,18.75 10.79,18.92 v6.99,18.92
  Bottom 0.254: v38.1,19.56 37.08,20.57 35.43,20.57 30.61,20.57 29.59,19.56 28.7,18.67 28.32,18.67 26.16,18.67 25.91,18.92 v6.99,18.92
BATT_V
  Top 0.203: IC1.27 12.67,19.97 12.45,20.19 11.68,20.19 11.43,20.45 R3.1
  Top 0.254: R6.2 9,20.83 10.16,20.83 C7.1 10.27,20.83 11.3,20.83 11.32,20.83 R3.1
CAN_HI
  Top 0.254: R14.2 55.77,17.13 55.75,17.14 IC4.7 53.47,17.14 52.32,17.14 51.31,18.16 51.31,21.59 51.31,21.72 49.78,23.24 49.78,26.54 47.5,28.83 44.07,28.83 42.67,28.83 33.4,28.83 JP1.6
  Bottom 0.254: X2.3 34.29,34.16 34.29,33.02 JP1.6
CAN_LO
  Top 0.254: R15.2 55.77,15.89 55.75,15.88 IC4.6 52.07,15.88 51.94,15.88 50.8,17.02 50.8,19.56 50.8,21.21 50.67,21.34 49.28,22.73 49.28,25.27 49.28,26.42 48.77,26.92 47.37,28.32 43.69,28.32 42.67,28.32 31.37,28.32 JP1.7 29.21,33.78 28.83,34.16 28.81,34.14 X2.5
CAN_RX  (via drill 0.51)
  Top 0.254: v13.97,12.06 IC1.11 | IC4.4 47.93,13.51 v47.37,12.95
  Bottom 0.254: v47.37,12.95 44.96,10.54 31.24,10.54 27.81,7.11 22.73,7.11 18.92,7.11 17.27,7.11 14.73,9.65 13.97,10.41 13.97,11.81 v13.97,12.06
CAN_TX  (via drill 0.51)
  Top 0.254: IC1.12 14.62,12.69 14.86,12.45 14.86,11.56 15.24,11.18 15.24,10.79 | 15.24,10.79 R34.2 15.24,10.79 | 15.24,10.79 16,10.79 v16.64,11.43 | v44.83,18.41 IC4.1
  Bottom 0.254: v16.64,11.43 19.05,11.43 19.3,11.68 22.99,11.68 23.5,11.18 30.23,11.18 30.61,11.56 37.97,11.56 41.27,14.86 v44.83,18.41
GND  (via drill 0.51)
  Top 0.203: 14.86,20.32 14.86,20.57
  Top 0.254: C14.2 6.97,30.48 C17.2 | IC3.12 40.53,18.43 41.02,18.92 | IC1.24 14.62,20.08 14.86,20.32 | 9.4,15.24 9.91,15.24 10.54,15.88 10.92,15.88 10.94,15.86 IC1.5
  Top 0.381: R22.1 v8.13,34.29
  Bottom 0.381: v8.13,34.29 6.35,34.29
  other vias: 10.41,10.41 21.59,12.57 6.35,15.62 4.06,11.3 66.04,14.48 63.5,11.05 60.83,12.7 63.5,23.75 58.93,16.26 63.5,14.35 66.04,12.83 9.65,26.16 6.48,20.83 2.16,36.96 17.53,23.62 1.14,26.8 15.24,15.11 63.5,12.7 60.83,11.05 50.8,12.32 63.5,21.08 63.5,18.67 65.15,21.08 61.85,21.08 65.15,23.75 61.85,23.75 61.59,18.67 65.79,26.67
  pour Top (isolate 0.305): 0,0 0,43.18 1.78,43.18 1.78,38.99 6.22,38.99 6.73,38.48 6.73,29.97 21.46,29.97 25.15,33.66 25.15,43.18 68.58,43.18 68.58,0
  pour Bottom (isolate 0.305): 0,0 0,43.18 1.78,43.18 1.78,38.99 6.22,38.99 6.73,38.48 6.73,29.97 21.46,29.97 25.15,33.66 25.15,43.18 68.58,43.18 68.58,0
  pour Top (isolate 0.305, no thermals): 61.85,23.75 61.85,18.54 65.15,18.54 65.15,23.75
  pour Top (isolate 0.305, no thermals): 60.83,11.05 66.04,11.05 66.04,14.35 60.83,14.35
J1850BUS+  (via drill 0.51)
  Top 0.254: D1.1 25.4,9.14 25.4,9.54 R30.1 24.13,10.92 v24.13,12.06 | X2.7 36.43,36.98 38.48,34.92 38.48,31.37 JP1.3 | R21.1 37.47,13.97 R28.1 36.21,14.72 v35.81,15.11
  Bottom 0.254: v24.13,12.06 24.38,12.32 30.61,12.32 33.4,15.11 v35.81,15.11 39.75,15.11 40.51,15.88 40.51,29.34 JP1.3
J1850BUS+_TX  (via drill 0.51)
  Top 0.254: IC1.3 10.18,17.16 9.03,17.16 v8.76,16.89 | Q9.1 21.7,5.35 v21.59,5.46
  Bottom 0.254: v21.59,5.46 11.56,5.46 11.43,5.59 8.76,8.26 v8.76,16.89
J1850BUS-  (via drill 0.51)
  Top 0.254: R31.2 38.09,12.08 37.97,12.19 37.63,12.53 Q8.3 35.56,12.57 35.18,12.95 v34.16,12.95 30.1,12.95 29.83,13.22 R29.1 | X2.6 40.11,36.98 41.91,35.18 JP1.2
  Bottom 0.254: v34.16,12.95 38.48,12.95 41.02,15.49 41.02,16.26 41.02,29.59 JP1.2
J1850BUS-_TX  (via drill 0.51)
  Top 0.254: IC1.4 10.41,16.51 10.03,16.51 v9.78,16.26 | R32.1 32.27,12.08 31.75,11.56 v31.75,9.53
  Bottom 0.254: v31.75,9.53 28.83,6.6 28.19,6.6 21.34,6.6 20.83,6.1 11.81,6.1 9.4,8.51 9.4,8.76 9.4,15.49 9.4,15.88 9.65,16.13 v9.78,16.26
K-LINE  (via drill 0.51)
  Top 0.254: 59.69,30.35 Q4.3 | R12.1 28.83,19.05 v28.32,19.56 | X2.4 31.52,34.06 31.5,34.04 31.52,34.01
  Top 0.381: 59.69,30.35 59.69,30.99 59.69,31.11 59.98,31.41 R11.2 63.5,34.67 63.5,34.8 58.29,40.01 33.02,40.01 31.52,38.51 X2.4 | JP1.5 31.52,33.25 31.52,34.01
  Bottom 0.254: v28.32,19.56 28.32,23.11 28.32,24.51 JP1.5
L-LINE
  Top 0.381: JP1.4 35.69,31.62 35.69,34.8 33.51,36.98 X2.8 32.91,37.07 32.89,37.08 34.67,38.86 50.29,38.86 52.07,37.08 R8.2 54.82,31.41 55.88,30.35 Q3.3
N$1
  Top 0.254: R28.2 34.8,13.97 33.91,14.86 IC3.7
N$3
  Top 0.254: R29.2 32.77,15.61 32.77,15.88 32.77,16 33.24,16.48 IC3.6
N$4
  Top 0.254: Q4.1 58.74,27.49 58.93,27.3 59.04,27.19 R13.1
N$5
  Top 0.254: Q3.1 54.93,27.49 55.12,27.3 55.23,27.19 R7.1
N$6
  Top 0.254: IC3.5 33.01,17.13 32.51,16.64 32.38,16.51 32,16.13 32,15.75 31.5,15.24 R33.1 30.11,16.26 29.84,16.26 29.84,16.5 R10.2
N$7
  Top 0.254: IC3.8 39.75,15.75 39.75,14.97 R21.2
N$8
  Top 0.254: R19.2 6.99,33.02 7,33.01 R20.2
  Top 0.381: R20.2 7,31.61 7.11,31.5 7.62,31.5 8,31.11 8,30.35 8.38,29.97 9.94,29.97 U2.1
N$9
  Top 0.254: Q7.3 27.9,11.3 27.81,11.3 D1.2
N$10
  Top 0.254: C12.1 57.15,18.41 57.02,18.29 56.88,18.43 R14.1
N$11
  Top 0.254: R16.2 53.98,20.32 53.98,18.72 IC4.8
N$12
  Top 0.254: R23.2 41.27,17.77 41.27,17.65 41.27,16.52 R17.1 41.27,16.51 41.24,16.48 IC3.9
N$13
  Top 0.254: R12.2 31.88,19.05 33.15,17.78 33.78,17.78 IC3.4
N$14
  Top 0.254: D3.1 39.24,10.41 38.88,10.78 R31.1
N$18
  Top 0.254: Q7.1 26.97,9.06 26.92,9.02 27.29,8.65 R24.2 27.18,7.62 27.01,7.45 Q9.3
N$22
  Top 0.254: Q10.3 7.45,36.66 5.84,35.05 5.7,34.91 R22.2 5.71,34.29 5.7,34.27 R19.1
N$24
  Top 0.254: D2.2 22.86,11.18 22.86,10.78 R30.2
N$25
  Top 0.254: Q8.1 34.56,10.43 34.54,10.41 34.18,10.78 R32.2
N$26
  Top 0.254: IC1.17 18.3,15.86 18.67,15.49 18.67,14.99 19.68,13.97 20.07,13.97 C4.A
N$27
  Top 0.254: C13.1 57.04,14.59 57.02,14.61 57.01,14.59 R15.1
N$30
  Top 0.254: LED3.C 23.24,17.78 R4.2
N$31
  Top 0.254: LED4.C 23.37,16.51 R5.1
N$32
  Top 0.254: R2.1 2.54,34.92 2.42,35.04 LED5.A
N$34
  Top 0.508: U3.4 66.75,11.75 C16.1
N$35
  Top 0.254: LED1.C 23.24,20.32 R35.2
N$36
  Top 0.254: LED2.C 23.24,19.05 R37.1
OSC1
  Top 0.203: IC1.6 10.51,15.21 10.29,14.99 9.91,14.61 7.75,14.61 6.22,14.61 5.71,14.61 5.2,15.12 5.2,15.63 | Y1.3 5.2,15.63 | 5.2,15.63 5.21,15.62
  Top 0.254: 5.21,16.89 5.2,16.9 Y1.3 5.13,17.09 5.08,17.14 5.07,17.16 C2.1
OSC2
  Top 0.203: IC1.7 10.13,13.72 9.14,13.72 7.87,13.72 7.49,13.34 | 7.5,13.34 Y1.1
  Top 0.254: 7.49,13.34 7.5,13.34 | 7.49,13.34 Y1.1 | C3.1 7.49,11.92 7.49,13.34
PWM/!VPW  (via drill 0.51)
  Top 0.254: IC1.28 10.08,19.51 v9.78,19.81 | Q10.1 3.94,36.37 v3.94,35.69
  Bottom 0.254: v9.78,19.81 3.94,25.65 2.41,27.18 2.41,27.56 2.41,34.16 v3.94,35.69
PWM_RX  (via drill 0.51)
  Top 0.254: IC1.2 9.55,17.81 9.4,17.97 v9.4,18.03 | R27.1 31.11,21.59 31.37,21.59 32.38,20.57 33.15,19.81 33.23,19.73 IC3.1 35.26,19.73 v35.31,19.68
  Bottom 0.254: 35.05,19.43 v35.31,19.68 35.18,19.68 34.92,19.43 30.1,19.43 29.72,19.05 28.83,18.16 12.95,18.16 9.91,18.16 9.78,18.16 9.53,18.16 v9.4,18.03
RESET
  Top 0.254: R1.1 12.7,20.83 13.32,20.21 IC1.26
RST_NVM  (via drill 0.51)
  Top 0.254: R5.2 20.95,16.51 v19.18,16.51 IC1.18 | JP9.1 39.88,21.59 v39.5,21.21
  Bottom 0.254: v19.18,16.51 33.02,16.51 33.4,16.89 33.91,16.89 38.86,16.89 39.37,17.4 39.5,17.53 40.01,18.03 40.01,18.29 40.01,20.7 v39.5,21.21
RX-I  (via drill 0.51)
  Top 0.254: JP8.TXO 31.75,1.27 24.13,1.27 23.75,1.27 20.19,4.83 20.19,5.97 20.19,7.49 18.92,8.76 v18.54,9.14 | IC1.13 15.27,12.8 v15.75,12.32
  Bottom 0.254: v15.75,12.32 15.75,9.91 16.51,9.14 18.41,9.14 v18.54,9.14
RX-STAT
  Top 0.254: IC1.21 18.07,19.56 19.18,19.56 20.07,19.56 20.83,20.32 R35.1
TX-O
  Top 0.254: IC1.14 17.22,13.51 17.78,12.95 17.78,12.32 R25.2 20.05,12.08 20.07,12.06 20.7,11.43 20.7,5.08 21.59,4.19 26.67,4.19 28.83,4.19 JP8.RXI
TX-STAT
  Top 0.254: IC1.20 17.68,17.81 18.03,18.16 18.03,18.67 18.41,19.05 20.83,19.05 R37.2
VBAT  (via drill 0.51)
  Top 0.254: R10.1 31.11,16.51 31.11,16.64 v32,17.53 | IC3.3 34.53,18.43 35.05,17.91 35.56,17.91 v35.69,17.78
  Top 0.381: 31.11,16.64 31.13,16.62 R10.1 | 14.99,29.59 14.98,29.59 U2.3 | 25.79,31.36 25.91,31.24
  Top 0.508: C14.1 8.13,29.21 v8.51,28.83 | 25.79,31.36 D4.C 22.72,31.36 21.72,30.35 15.49,30.35 14.99,29.84 U2.3 | v26.67,21.72 26.67,18.16 27.3,17.53 30.23,17.53 31.11,16.64 | v12.7,28.83 14.22,28.83 14.99,29.59 | R8.1 52.07,28.45 v52.83,29.21 | R11.1 63.5,28.45 v62.74,29.21 | v46.35,27.18 45.97,27.56 28.83,27.56 26.67,29.72 JP1.8 25.91,31.24
  Bottom 0.254: v32,17.53 35.43,17.53 v35.69,17.78
  Bottom 0.508: v8.51,28.83 v12.7,28.83 | JP1.8 v26.67,21.72 | v62.74,29.21 v52.83,29.21 50.8,27.18 v46.35,27.18
VBATT_RAW  (via drill 0.51)
  Top 0.381: D4.A | D4.A v22.86,28.7 | D4.A 22.61,27.3 | 22.73,27.3 22.86,27.18 D4.A | R3.2 11.43,24.38 12.32,25.27 21.07,25.27 D4.A
  Bottom 0.381: X2.9 28.6,36.98 22.86,31.24 v22.86,28.7
VCC  (via drill 0.51)
  Top 0.254: 5.59,31.75 R20.1 5.7,31.64 5.71,31.62 5.7,31.61 | Q7.2 28.87,9.06 28.59,8.78 | C9.A 62.2,8.99
  Top 0.381: 5.7,31.61 C17.1 | 28.59,8.78 R24.1 | v34.8,8.51 30.48,8.51 29.93,9.06 Q7.2 | 3.81,31.75 3.81,21.46 1.65,19.3 1.65,10.29 8.13,3.81 v17.78,3.81 | 3.81,31.75 5.59,31.75 | 62.2,8.99 62.2,8.92 62.23,8.89 | 62.23,8.89 v52.45,8.89 52.45,12.19 53.47,13.21 57.78,13.21 58.29,13.72 58.29,14.48 58.93,15.11 61.72,15.11 62.2,14.63 U3.1 | C10.1 62.23,7.35 62.23,8.89 | 3.81,31.75 3.81,32.37 3.74,32.44 | 3.74,32.44 R2.2 | v4.45,34.29 4.45,33.15 3.74,32.44
  Top 0.508: 62.2,8.99 U3.3
  Bottom 0.381: v17.78,3.81 25.4,3.81 26.67,5.08 31.37,5.08 v34.8,8.51 52.07,8.51 v52.45,8.89 | v4.45,34.29 5.84,35.69 v8.64,35.69
  other vias: 12.7,36.7 14.73,36.7 10.67,36.7 10.67,34.42 12.7,34.42 14.73,34.42 14.73,38.86 12.7,38.86 10.67,38.86 10.67,41.15 12.7,41.15 14.73,41.15 17.02,38.86 17.02,36.7 17.02,34.42 8.51,38.86 12.7,32.26
  pour Bottom (isolate 0.305): 2.54,43.18 24.38,43.18 24.38,34.16 20.95,30.73 7.49,30.73 7.49,38.86 6.6,39.75 2.54,39.75
  pour Top (isolate 0.305, no thermals): 2.54,43.18 24.38,43.18 24.38,34.16 20.95,30.73 7.49,30.73 7.49,38.86 6.6,39.75 2.54,39.75

### Text on the board
Bottom: 10/13/10
tPlace: POWER | LO | HI | K | L | + | - | CAN | LINE | J1850 | GND | VBAT | GND | RST_NVM | RX | TX | OBDRX | OBDTX | NC | TX-O | RX-I | NC | NC | GND | OBD-II-UART | GRN | BLK